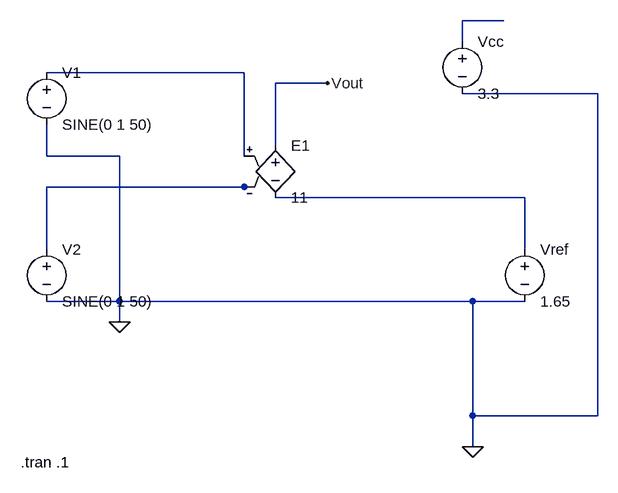
[diagram p0: schematic INA333_stage.asc]
INA333_stage.asc, the LTspice schematic file:
Version 4.1
SHEET 1 1236 680
WIRE 1008 -64 944 -64
WIRE 944 -32 944 -64
WIRE 608 16 304 16
WIRE 736 32 656 32
WIRE 1152 48 944 48
WIRE 656 128 656 32
WIRE 304 144 304 96
WIRE 416 144 304 144
WIRE 608 144 608 16
WIRE 608 192 304 192
WIRE 624 192 608 192
WIRE 1040 208 656 208
WIRE 304 288 304 192
WIRE 1040 288 1040 208
WIRE 416 368 416 144
WIRE 416 368 304 368
WIRE 960 368 416 368
WIRE 1040 368 960 368
WIRE 416 400 416 368
WIRE 960 544 960 368
WIRE 1152 544 1152 48
WIRE 1152 544 960 544
WIRE 960 592 960 544
FLAG 960 592 0
FLAG 416 400 0
FLAG 736 32 Vout
SYMBOL voltage 304 0 R0
WINDOW 123 24 124 Left 2
WINDOW 39 0 0 Left 0
SYMATTR InstName V1
SYMATTR Value SINE(0 1 50)
SYMBOL voltage 304 272 R0
WINDOW 123 0 0 Left 0
WINDOW 39 0 0 Left 0
SYMATTR InstName V2
SYMATTR Value SINE(0 1 50)
SYMBOL voltage 1040 272 R0
WINDOW 123 0 0 Left 0
WINDOW 39 0 0 Left 0
SYMATTR InstName Vref
SYMATTR Value 1.65
SYMBOL voltage 944 -48 R0
WINDOW 123 0 0 Left 0
WINDOW 39 0 0 Left 0
SYMATTR InstName Vcc
SYMATTR Value 3.3
SYMBOL e 656 112 R0
SYMATTR InstName E1
SYMATTR Value 11
TEXT 264 616 Left 2 !.tran .1

The netlist it stands for:
* INA333_stage.asc
V1 N002 0 SINE(0 1 50)
V2 N003 0 SINE(0 1 50)
Vref N004 0 1.65
Vcc N001 0 3.3
E1 Vout N004 N002 N003 11
.tran .1
.backanno
.end